# Altium schematic sheet is42s32800j.SchDoc: RAM
size A4; Date: 10.02.2025; CheckedBy: BCY; DrawnBy: miaow; DocumentNumber: 4; Revision: v0.0.1; SheetNumber: 4; SheetTotal: 12; Sample: A0; Url: github.com/miaow-cn/pcb-lib; Liscense: GPLv3; Board: MIAOW FOC BOARD; BoardType: MAIN_PCB; Desc: sdram of 32-bit data size
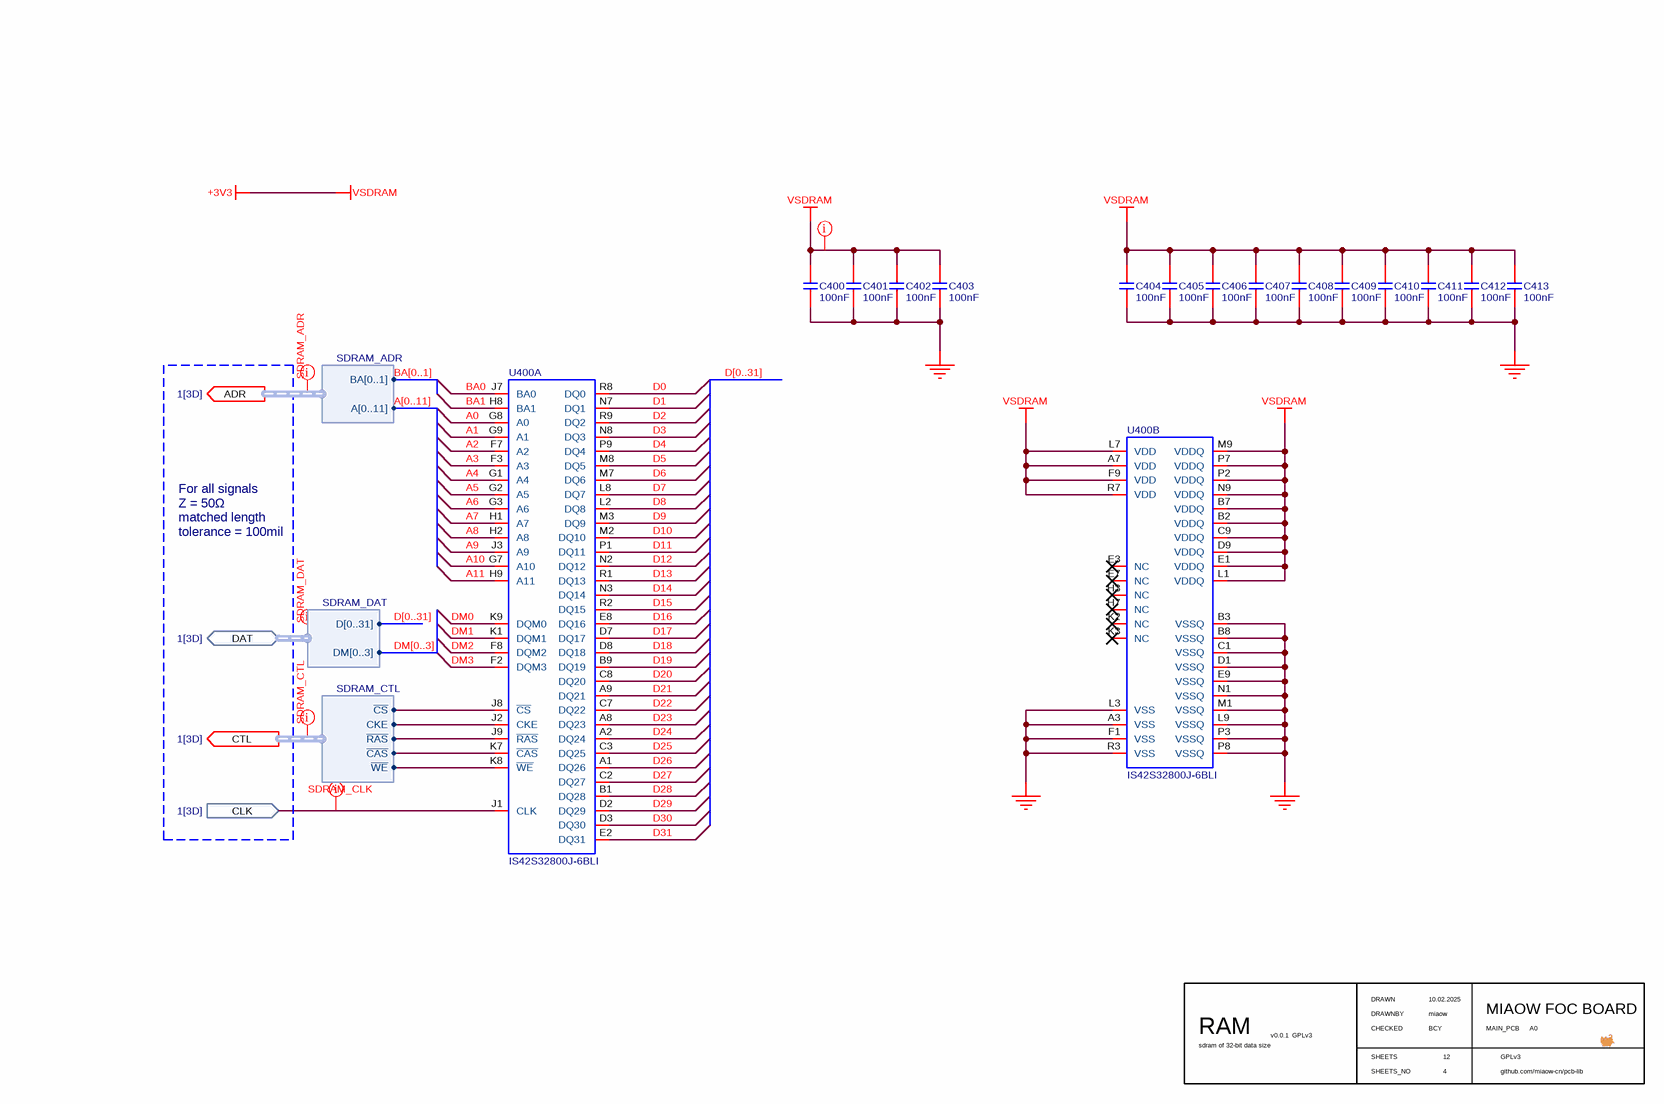
[diagram p0: is42s32800j.SchDoc]

## Parts
C400  value 100nF  [C0402]  (hidden comment: C-NOMO)
C401  value 100nF  [C0402]  (hidden comment: C-NOMO)
C402  value 100nF  [C0402]  (hidden comment: C-NOMO)
C403  value 100nF  [C0402]  (hidden comment: C-NOMO)
C404  value 100nF  [C0402]  (hidden comment: C-NOMO)
C405  value 100nF  [C0402]  (hidden comment: C-NOMO)
C406  value 100nF  [C0402]  (hidden comment: C-NOMO)
C407  value 100nF  [C0402]  (hidden comment: C-NOMO)
C408  value 100nF  [C0402]  (hidden comment: C-NOMO)
C409  value 100nF  [C0402]  (hidden comment: C-NOMO)
C410  value 100nF  [C0402]  (hidden comment: C-NOMO)
C411  value 100nF  [C0402]  (hidden comment: C-NOMO)
C412  value 100nF  [C0402]  (hidden comment: C-NOMO)
C413  value 100nF  [C0402]  (hidden comment: C-NOMO)
U400  IS42S32800J-6BLI  [IS42S32800J-6BLI]  (parts A,B of 2)

## Ports
ADR (out, harness SDRAM_ADR, see 1[3D]), CLK (in, see 1[3D]), CTL (out, harness SDRAM_CTL, see 1[3D]), DAT (bidir, harness SDRAM_DAT, see 1[3D])

## Harnesses
SDRAM_CTL: ~{CS}, CKE, ~{RAS}, ~{CAS}, ~{WE}
SDRAM_ADR: BA[0..1], A[0..11]
SDRAM_DAT: DM[0..3], D[0..31]

## Nets
+3V3: C400.2 C401.2 C402.2 C403.2 C404.2 C405.2 C406.2 C407.2 C408.2 C409.2 C410.2 C411.2 C412.2 C413.2 U400.A7(VDD) U400.B2(VDDQ) U400.B7(VDDQ) U400.C9(VDDQ) U400.D9(VDDQ) U400.E1(VDDQ) U400.F9(VDD) U400.L1(VDDQ) U400.L7(VDD) U400.M9(VDDQ) U400.N9(VDDQ) U400.P2(VDDQ) U400.P7(VDDQ) U400.R7(VDD)  [also labelled VSDRAM]
GND: C400.1 C401.1 C402.1 C403.1 C404.1 C405.1 C406.1 C407.1 C408.1 C409.1 C410.1 C411.1 C412.1 C413.1 U400.A3(VSS) U400.B3(VSSQ) U400.B8(VSSQ) U400.C1(VSSQ) U400.D1(VSSQ) U400.E9(VSSQ) U400.F1(VSS) U400.L3(VSS) U400.L9(VSSQ) U400.M1(VSSQ) U400.N1(VSSQ) U400.P3(VSSQ) U400.P8(VSSQ) U400.R3(VSS)
A0: U400.G8(A0)
A1: U400.G9(A1)
A2: U400.F7(A2)
A3: U400.F3(A3)
A4: U400.G1(A4)
A5: U400.G2(A5)
A6: U400.G3(A6)
A7: U400.H1(A7)
A8: U400.H2(A8)
A9: U400.J3(A9)
A10: U400.G7(A10)
A11: U400.H9(A11)
BA0: U400.J7(BA0)
BA1: U400.H8(BA1)
CLK: U400.J1(CLK) ; port CLK
D0: U400.R8(DQ0)
D1: U400.N7(DQ1)
D2: U400.R9(DQ2)
D3: U400.N8(DQ3)
D4: U400.P9(DQ4)
D5: U400.M8(DQ5)
D6: U400.M7(DQ6)
D7: U400.L8(DQ7)
D8: U400.L2(DQ8)
D9: U400.M3(DQ9)
D10: U400.M2(DQ10)
D11: U400.P1(DQ11)
D12: U400.N2(DQ12)
D13: U400.R1(DQ13)
D14: U400.N3(DQ14)
D15: U400.R2(DQ15)
D16: U400.E8(DQ16)
D17: U400.D7(DQ17)
D18: U400.D8(DQ18)
D19: U400.B9(DQ19)
D20: U400.C8(DQ20)
D21: U400.A9(DQ21)
D22: U400.C7(DQ22)
D23: U400.A8(DQ23)
D24: U400.A2(DQ24)
D25: U400.C3(DQ25)
D26: U400.A1(DQ26)
D27: U400.C2(DQ27)
D28: U400.B1(DQ28)
D29: U400.D2(DQ29)
D30: U400.D3(DQ30)
D31: U400.E2(DQ31)
DM0: U400.K9(DQM0)
DM1: U400.K1(DQM1)
DM2: U400.F8(DQM2)
DM3: U400.F2(DQM3)
NetU400_J2: U400.J2(CKE) ; port CTL.CKE
NetU400_J8: U400.J8(~{CS}) ; port CTL.~{CS}
NetU400_J9: U400.J9(~{RAS}) ; port CTL.~{RAS}
NetU400_K7: U400.K7(~{CAS}) ; port CTL.~{CAS}
NetU400_K8: U400.K8(~{WE}) ; port CTL.~{WE}

Not connected (* = marked no-connect by the designer): U400 E3(NC)* E7(NC)* H3(NC)* H7(NC)* K2(NC)* K3(NC)*

## Buses and harness runs
bus A[0..11]
bus BA[0..1]
bus D[0..31]
bus DM[0..3]

## Layout directives
net class SDRAM_CTL: (no net found under the mark)
net class SDRAM_ADR: (no net found under the mark)
net class SDRAM_CLK: CLK
net class SDRAM_DAT: (no net found under the mark)
net class CLS_PWR: +3V3

## Notes on the sheet
- For all signals
  Z = 50Ω
  matched length tolerance = 100mil
- DRAWN
- CHECKED
- DRAWNBY
- SHEETS
- SHEETS_NO

## Library data of the parts
C400-C413 = C-NOMO: voltage: 25V; precision: 5%
U400 = IS42S32800J-6BLI: Supplier 1: LCSC; Supplier Part Number 1: C1351419; ClassName: BGA